# Altium schematic sheet fpga_v3.SchDoc
size A0
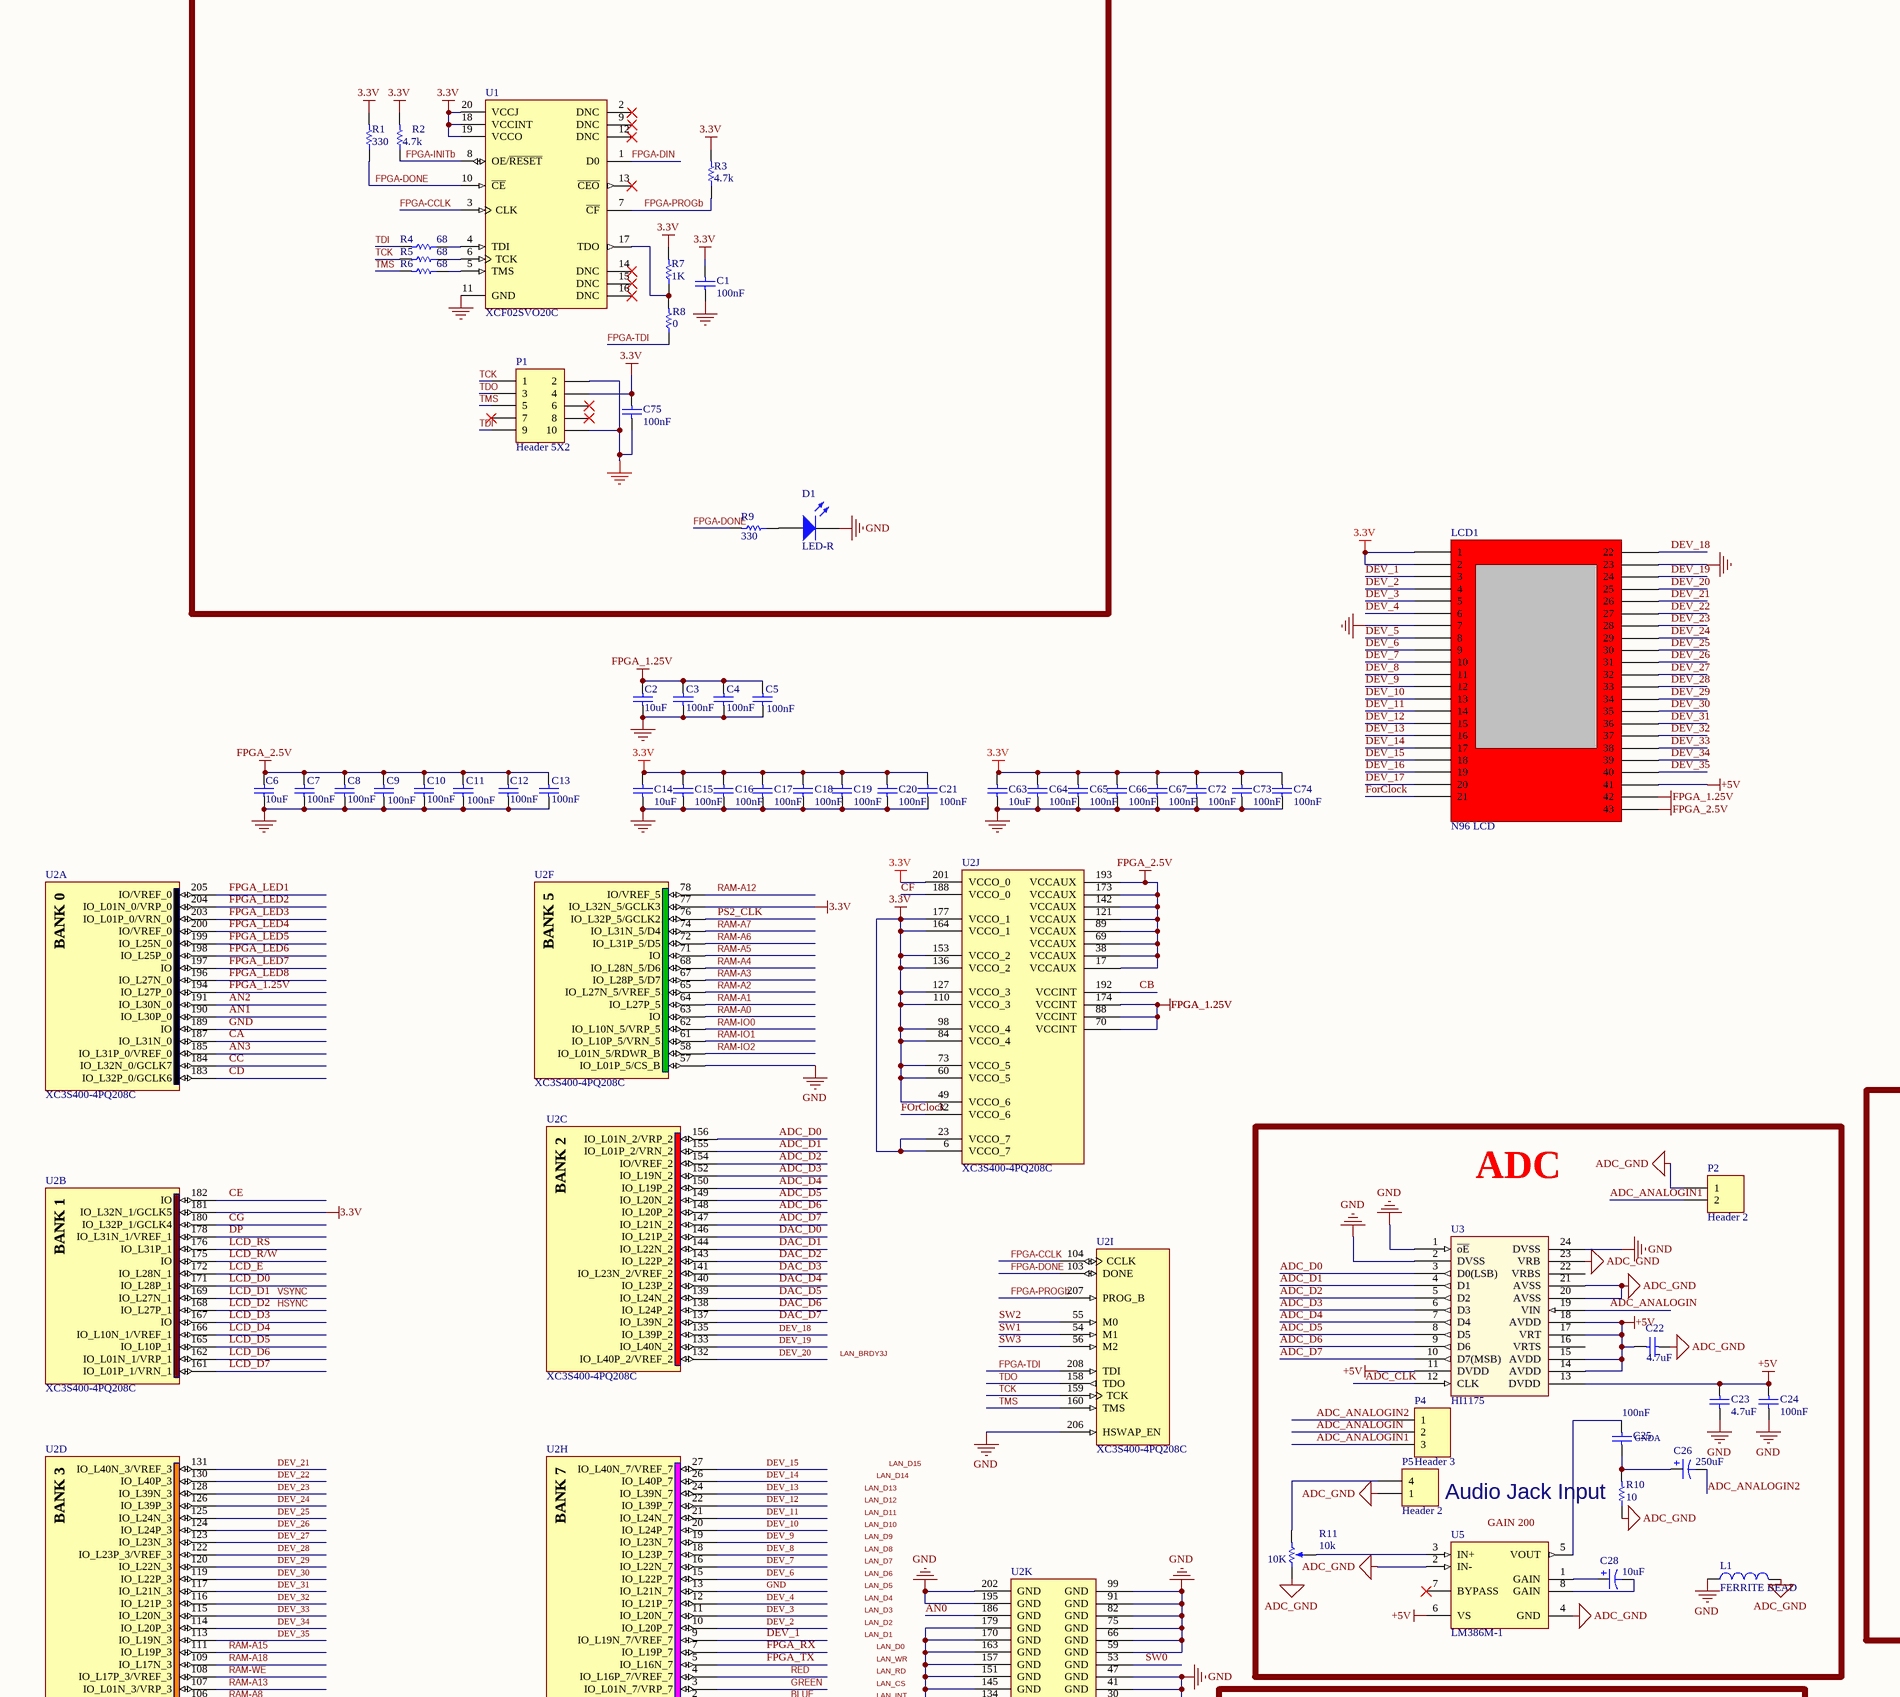
[diagram p0: fpga_v3.SchDoc, top left]
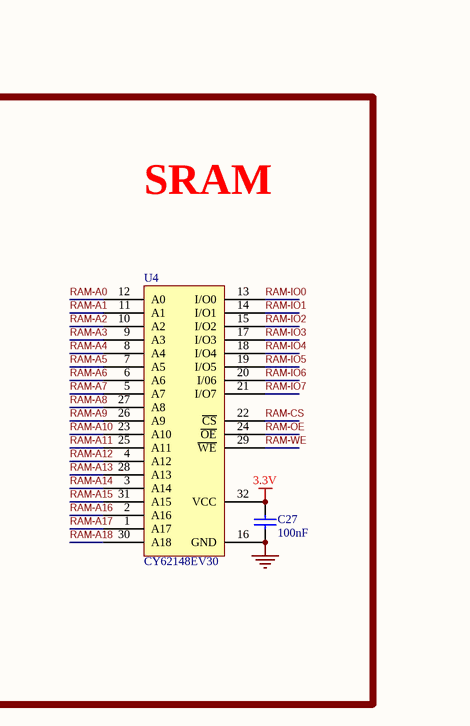
[diagram p1: fpga_v3.SchDoc, top right]
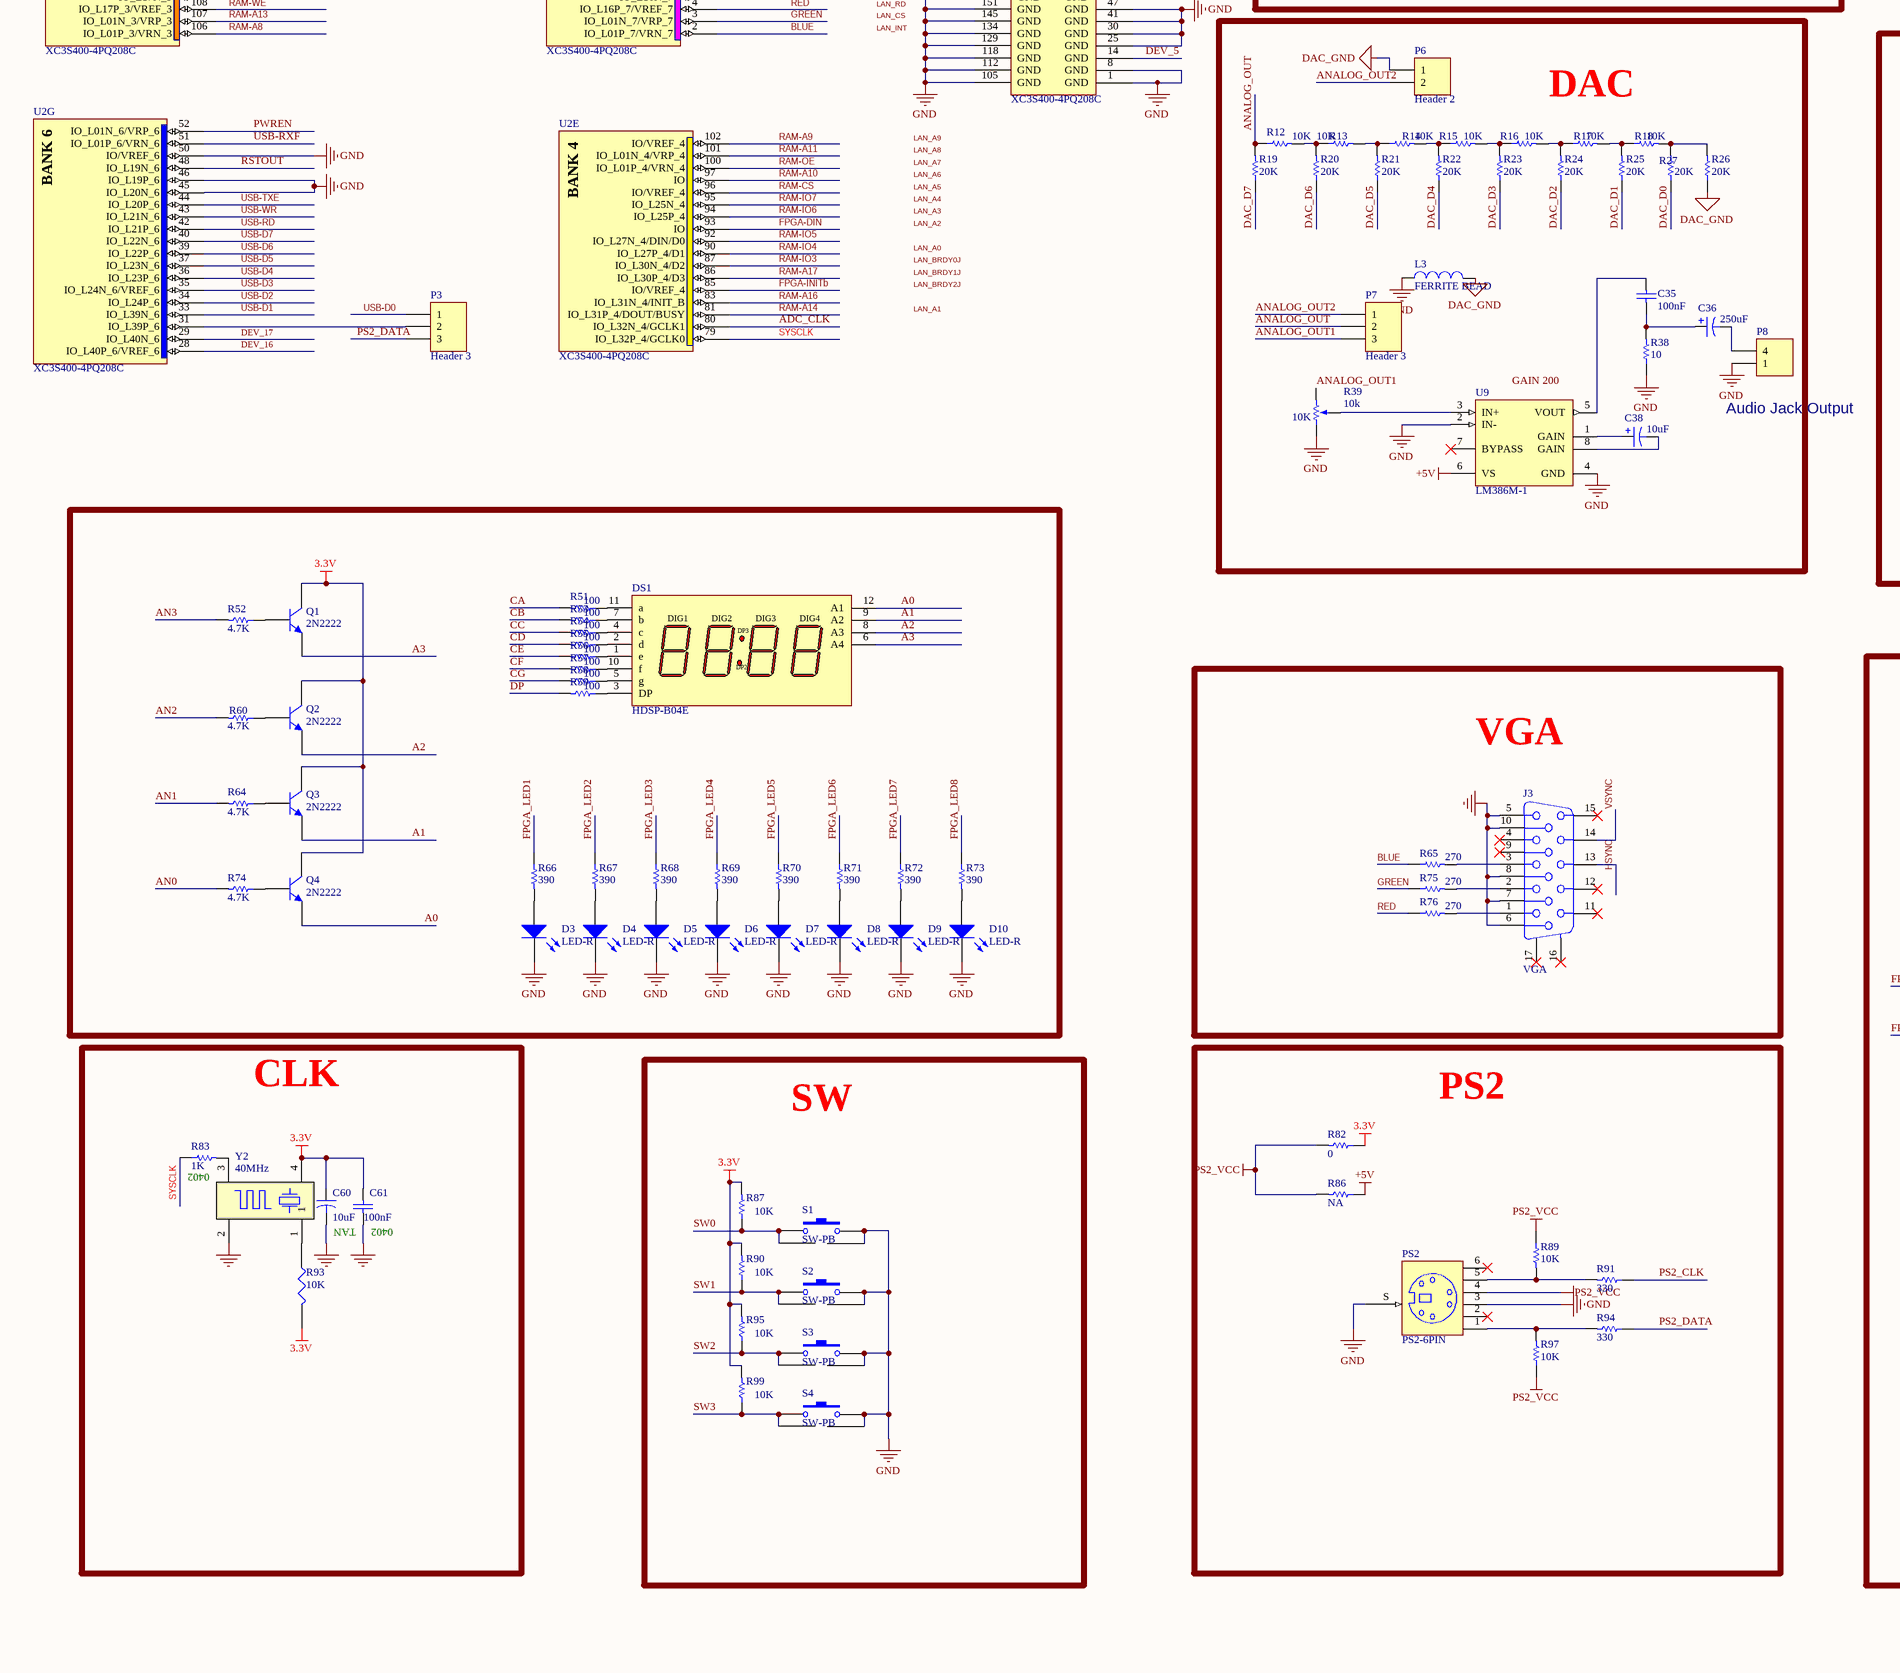
[diagram p2: fpga_v3.SchDoc, bottom left]
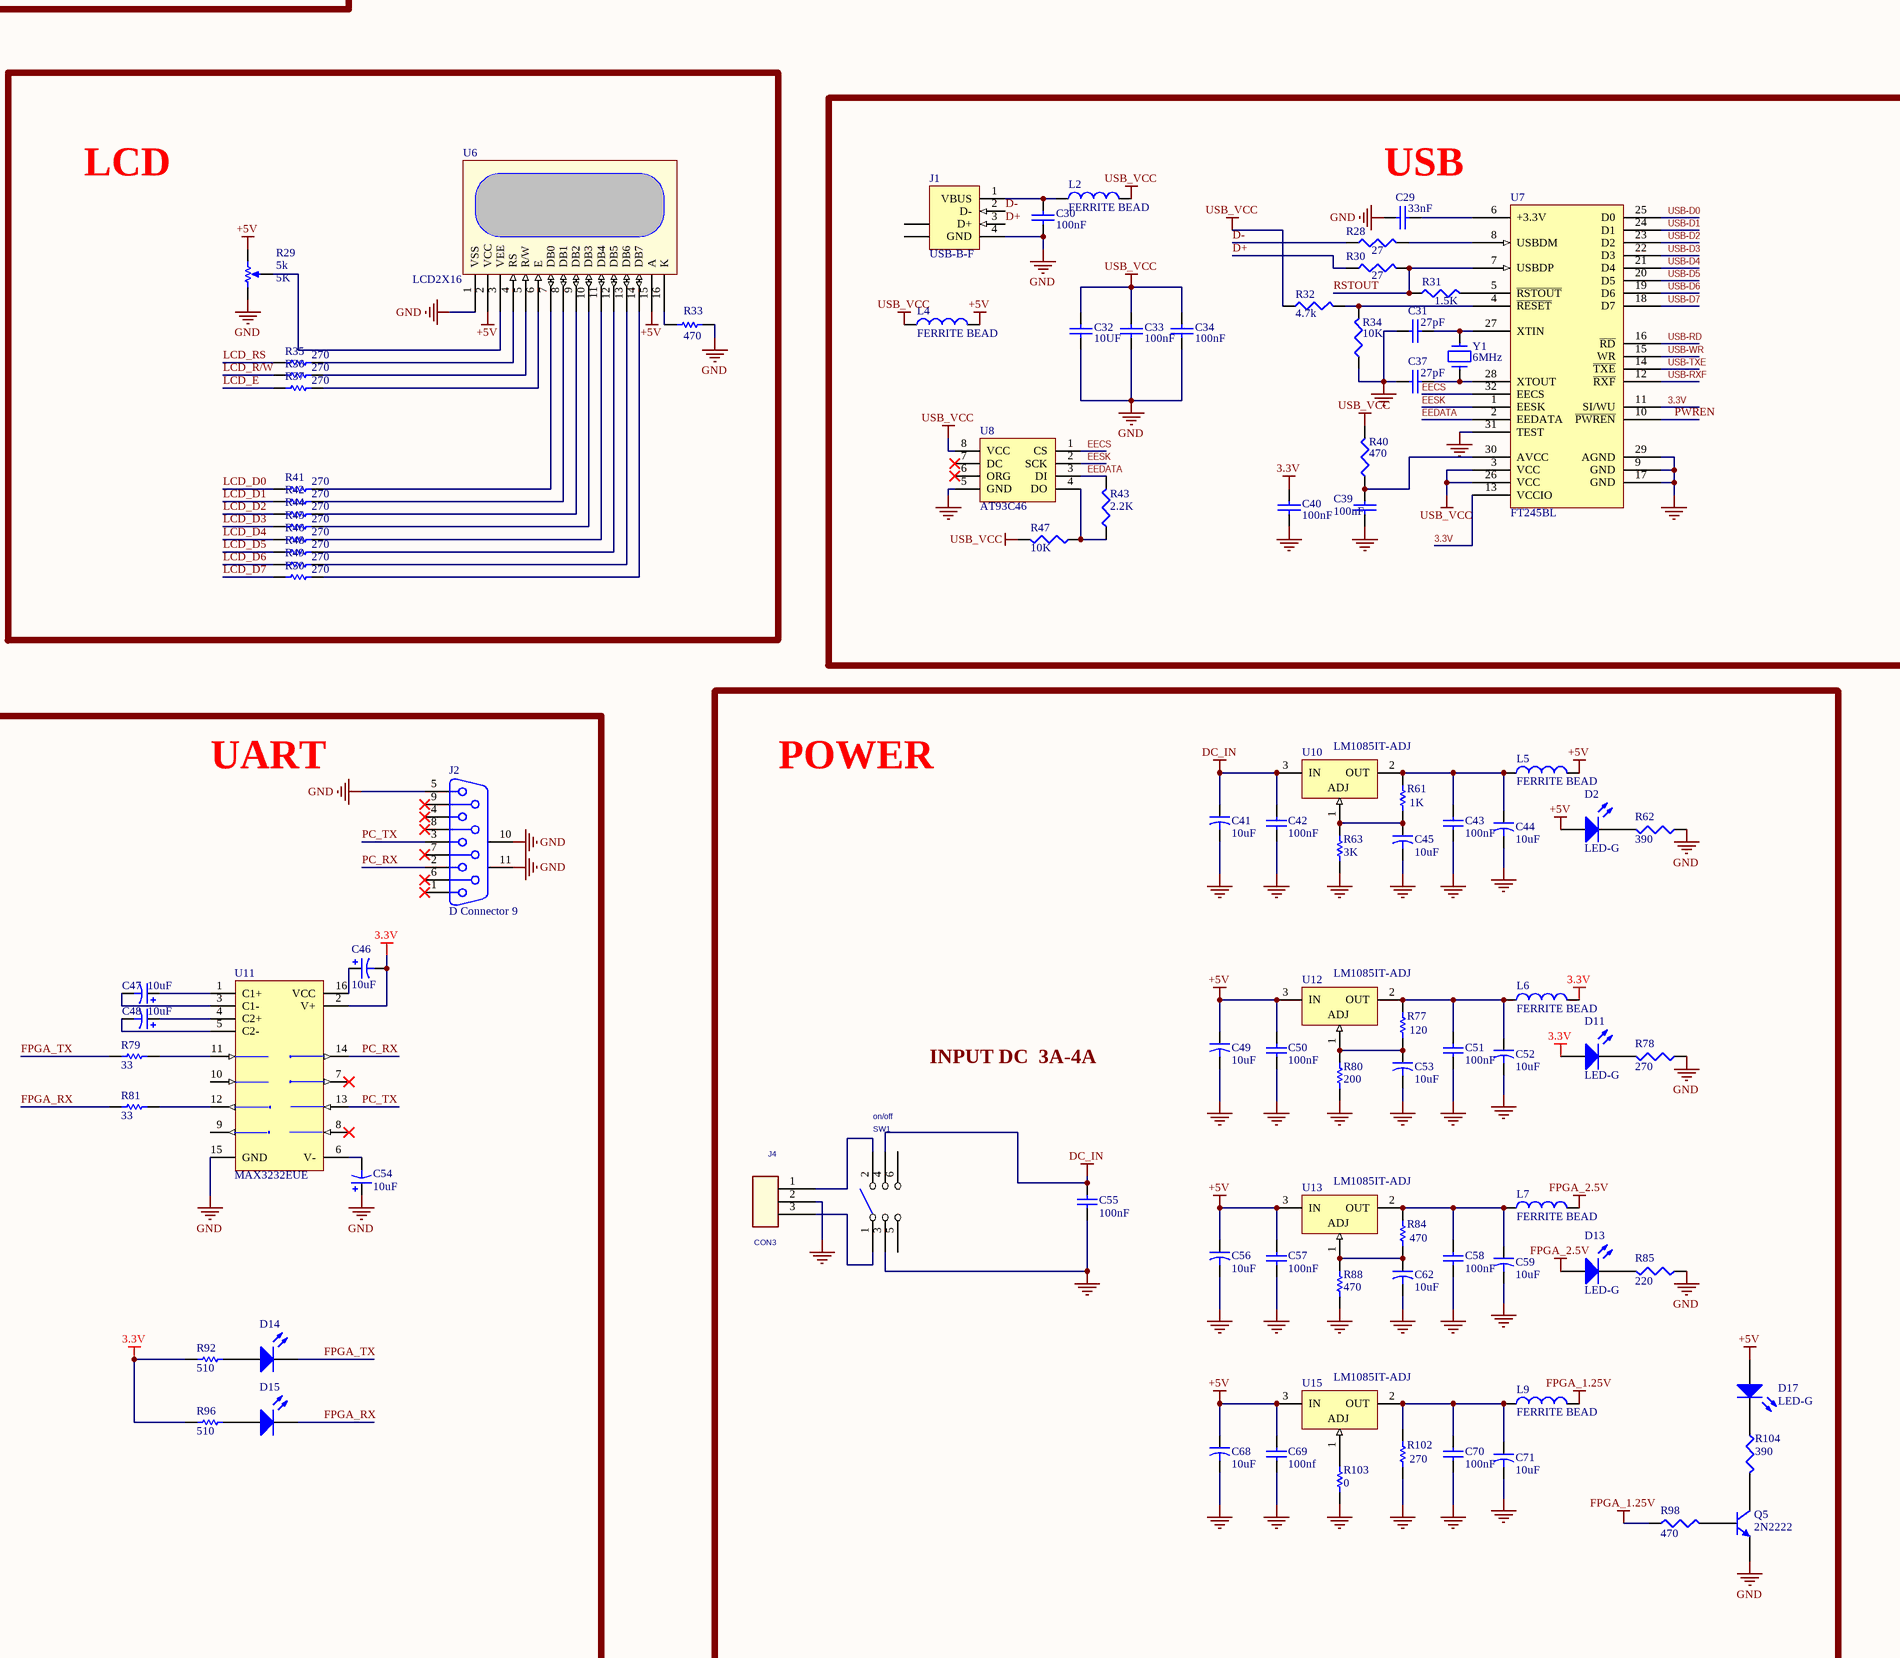
[diagram p3: fpga_v3.SchDoc, bottom right]

## Parts
C1  100nF  [0805]
C2  10uF  [0805]
C3  100nF  [0805]
C4  100nF  [0805]
C5  100nF  [0805]
C6  10uF  [0805]
C7  100nF  [0805]
C8  100nF  [0805]
C9  100nF  [0805]
C10  100nF  [0805]
C11  100nF  [0805]
C12  100nF  [0805]
C13  100nF  [0805]
C14  10uF  [0805]
C15  100nF  [0805]
C16  100nF  [0805]
C17  100nF  [0805]
C18  100nF  [0805]
C19  100nF  [0805]
C20  100nF  [0805]
C21  100nF  [0805]
C22  4.7uF  [0805]
C23  4.7uF  [0805]
C24  100nF  [0805]
C25  100nF  [0805]
C26  250uF  [1210]
C27  100nF  [0805]
C28  10uF  [0805]
C29  33nF  [0805]
C30  100nF  [0805]
C31  27pF  [0805]
C32  10UF  [0805]
C33  100nF  [0805]
C34  100nF  [0805]
C35  100nF  [0805]
C36  250uF  [1210]
C37  27pF  [0805]
C38  10uF  [0805]
C39  100nF  [0805]
C40  100nF  [0805]
C41  10uF  [0805]
C42  100nF  [0805]
C43  100nF  [0805]
C44  10uF  [0805]
C45  10uF  [0805]
C46  10uF  [0805]
C47  10uF  [0805]
C48  10uF  [0805]
C49  10uF  [0805]
C50  100nF  [0805]
C51  100nF  [0805]
C52  10uF  [0805]
C53  10uF  [0805]
C54  10uF  [0805]
C55  100nF  [0805]
C56  10uF  [0805]
C57  100nF  [0805]
C58  100nF  [0805]
C59  10uF  [0805]
C60  10uF  [c1206]
C61  100nF  [0805]
C62  10uF  [0805]
C63  10uF  [0805]
C64  100nF  [0805]
C65  100nF  [0805]
C66  100nF  [0805]
C67  100nF  [0805]
C68  10uF  [0805]
C69  100nf  [0805]
C70  100nF  [0805]
C71  10uF  [0805]
C72  100nF  [0805]
C73  100nF  [0805]
C74  100nF  [0805]
C75  100nF  [0805]
D1  LED-R  [0805AK]
D2  LED-G  [0805AK]
D3  LED-R  [0805AK]
D4  LED-R  [0805AK]
D5  LED-R  [0805AK]
D6  LED-R  [0805AK]
D7  LED-R  [0805AK]
D8  LED-R  [0805AK]
D9  LED-R  [0805AK]
D10  LED-R  [0805AK]
D11  LED-G  [0805AK]
D13  LED-G  [0805AK]
D14  LED-R  [0805AK]  (value not drawn)
D15  LED-R  [0805AK]  (value not drawn)
D17  LED-G  [0805AK]
DS1  HDSP-B04E  [HDSP-B4]
J1  USB-B-F  [USB2]
J2  D Connector 9  [DSUB1.385-2H9]
J3  VGA  [DB15SLC]
J4  CON3  [POWER JACK]
L1  FERRITE BEAD  [0805]
L2  FERRITE BEAD  [0805]
L3  FERRITE BEAD  [0805]
L4  FERRITE BEAD  [0805]
L5  FERRITE BEAD  [1206]
L6  FERRITE BEAD  [1206]
L7  FERRITE BEAD  [1206]
L9  FERRITE BEAD  [1206]
LCD1  N96 LCD  [Development]
P1  Header 5X2  [HDR2X5]
P2  Header 2  [HDR1X2]
P3  Header 3  [HDR1X3]
P4  Header 3  [HDR1X3]
P5  Header 2  [my_headphone]
P6  Header 2  [HDR1X2]
P7  Header 3  [HDR1X3]
P8  Header 2  [my_headphone]  (value not drawn)
PS2  PS2-6PIN  [PS2-6PIN]
Q1  2N2222  [SOT23_N]
Q2  2N2222  [SOT23_N]
Q3  2N2222  [SOT23_N]
Q4  2N2222  [SOT23_N]
Q5  2N2222  [SOT23_N]
R1  330  [0805]
R2  4.7k  [0805]
R3  4.7k  [0805]
R4  68  [0805]
R5  68  [0805]
R6  68  [0805]
R7  1K  [0805]
R8  0  [0805]
R9  330  [0805]
R10  10  [0805]
R11  10k  [VR5]
R12  10K  [0805]
R13  10K  [0805]
R14  10K  [0805]
R15  10K  [0805]
R16  10K  [0805]
R17  10K  [0805]
R18  10K  [0805]
R19  20K  [0805]
R20  20K  [0805]
R21  20K  [0805]
R22  20K  [0805]
R23  20K  [0805]
R24  20K  [0805]
R25  20K  [0805]
R26  20K  [0805]
R27  20K  [0805]
R28  27  [0805]
R29  5k  [POT MINI]
R30  27  [0805]
R31  1.5K  [0805]
R32  4.7k  [0805]
R33  470  [0805]
R34  10K  [0805]
R35  270  [0805]
R36  270  [0805]
R37  270  [0805]
R38  10  [0805]
R39  10k  [VR5]
R40  470  [0805]
R41  270  [0805]
R42  270  [0805]
R43  2.2K  [0805]
R44  270  [0805]
R45  270  [0805]
R46  270  [0805]
R47  10K  [0805]
R48  270  [0805]
R49  270  [0805]
R50  270  [0805]
R51  100  [0805]
R52  4.7K  [0805]
R53  100  [0805]
R54  100  [0805]
R55  100  [0805]
R56  100  [0805]
R57  100  [0805]
R58  100  [0805]
R59  100  [0805]
R60  4.7K  [0805]
R61  1K  [0805]
R62  390  [0805]
R63  3K  [0805]
R64  4.7K  [0805]
R65  270  [0805]
R66  390  [0805]
R67  390  [0805]
R68  390  [0805]
R69  390  [0805]
R70  390  [0805]
R71  390  [0805]
R72  390  [0805]
R73  390  [0805]
R74  4.7K  [0805]
R75  270  [0805]
R76  270  [0805]
R77  120  [0805]
R78  270  [0805]
R79  33  [0805]
R80  200  [0805]
R81  33  [0805]
R82  0  [0805]
R83  1K  [0805]
R84  470  [0805]
R85  220  [0805]
R86  NA  [0805]
R87  10K  [0805]
R88  470  [0805]
R89  10K  [0805]
R90  10K  [0805]
R91  330  [0805]
R92  510  [0805]
R93  10K  [0805]
R94  330  [0805]
R95  10K  [0805]
R96  510  [0805]
R97  10K  [0805]
R98  470  [0805]
R99  10K  [0805]
R102  270  [0805]
R103  0  [0805]
R104  390  [0805]
S1  SW-PB  [Buttom]
S2  SW-PB  [Buttom]
S3  SW-PB  [Buttom]
S4  SW-PB  [Buttom]
SW1  on/off  [SWITCH]
U1  XCF02SVO20C  [VOG20_L]
U2  XC3S400-4PQ208C  [PQ208_N]  (parts A,B,C,D,E,F,G,H,I,J,K of 11)
U3  HI1175  [SOIC127P1030X264-24N]
U4  CY62148EV30  [SOP32]
U5  LM386M-1  [D008_M]
U6  LCD2X16  [LCD]
U7  FT245BL  [sol-32]
U8  AT93C46  [so-8]
U9  LM386M-1  [D008_M]
U10  LM1085IT-ADJ  [DDPAK-EB3_M]
U11  MAX3232EUE  [SO-16]
U12  LM1085IT-ADJ  [DDPAK-EB3_M]
U13  LM1085IT-ADJ  [DDPAK-EB3_M]
U15  LM1085IT-ADJ  [DDPAK-EB3_M]
Y1  6MHz  [XTAL-2]
Y2  40MHz  [OSC-2]

## Blocks framed on the sheet
SRAM: C27 U4
ADC: C22-C26 C28 L1 P2 P4 P5 R10 R11 U3 U5
DAC: C35 C36 C38 L3 P6-P8 R12-R27 R38 R39 U9
LCD: R29 R33 R35-R37 R41 R42 R44-R46 R48-R50 U6
USB: C29-C34 C37 C39 C40 J1 L2 L4 R28 R30-R32 R34 R40 R43 R47 U7 U8 Y1
POWER: C41-C45 C49-C53 C55-C59 C62 C68-C71 D2 D11 D13 D17 J4 L5-L7 L9 Q5 R61-R63 R77 R78 R80 R84 R85 R88 R98 R102-R104 SW1 U10 U12 U13 U15
VGA: J3 R65 R75 R76
UART: C46-C48 C54 D14 D15 J2 R79 R81 R92 R96 U11
CLK: C60 C61 R83 R93 Y2
SW: R87 R90 R95 R99 S1-S4
PS2: PS2 R82 R86 R89 R91 R94 R97

## Nets
3.3V: C1.2 C14.2 C15.2 C16.2 C17.2 C18.2 C19.2 C20.2 C21.2 C27.2 C40.1 C46.2 C60.1 C61.2 C63.2 C64.2 C65.2 C66.2 C67.2 C72.2 C73.2 C74.2 C75.2 D11.1(A) L6.2 LCD1.1 LCD1.2 P1.4 Q1.3(B) Q2.3(B) Q3.3(B) Q4.3(B) R1.2 R2.2 R3.2 R7.2 R82.1 R87.2 R90.2 R92.1 R93.2 R95.2 R96.1 R99.2 U1.18(VCCINT) U1.19(VCCO) U1.20(VCCJ) U2.6(VCCO_7) U2.23(VCCO_7) U2.49(VCCO_6) U2.60(VCCO_5) U2.73(VCCO_5) U2.77(IO_L32N_5/GCLK3) U2.84(VCCO_4) U2.98(VCCO_4) U2.110(VCCO_3) U2.127(VCCO_3) U2.136(VCCO_2) U2.153(VCCO_2) U2.164(VCCO_1) U2.177(VCCO_1) U2.181(IO_L32N_1/GCLK5) U2.201(VCCO_0) U4.32(VCC) U7.11(SI/WU) U7.13(VCCIO) U11.2(V+) Y2.4
+5V: C22.2 C23.2 C24.2 C49.1 C50.1 C56.1 C57.1 C68.1 C69.1 D2.1(A) D17.1(A) L4.2 L5.2 LCD1.41 R29.2(BOT) R86.1 U3.11(DVDD) U3.13(DVDD) U3.14(AVDD) U3.15(AVDD) U3.17(VRT) U3.18(AVDD) U5.6(VS) U6.2(VCC) U6.15(A) U9.6(VS) U12.3(IN) U13.3(IN) U15.3(IN)
ADC_GND: C22.1 L1.2 P2.1 P5.1 R10.1 R11.1(TOP) U3.20(AVSS) U3.21(AVSS) U3.23(VRB) U5.2(IN-) U5.4(GND)
DAC_GND: L3.2 P6.1 R26.1
DC_IN: C41.1 C42.1 C55.2 SW1.4 U10.3(IN)
FPGA_1.25V: C2.2 C3.2 C4.2 C5.2 L9.2 LCD1.42 R98.1 U2.70(VCCINT) U2.88(VCCINT) U2.174(VCCINT) U2.194(IO_L27P_0)
FPGA_2.5V: C6.2 C7.2 C8.2 C9.2 C10.2 C11.2 C12.2 C13.2 D13.1(A) L7.2 LCD1.43 U2.17(VCCAUX) U2.38(VCCAUX) U2.69(VCCAUX) U2.89(VCCAUX) U2.121(VCCAUX) U2.142(VCCAUX) U2.173(VCCAUX) U2.193(VCCAUX)
GND: C1.1 C2.1 C3.1 C4.1 C5.1 C6.1 C7.1 C8.1 C9.1 C10.1 C11.1 C12.1 C13.1 C14.1 C15.1 C16.1 C17.1 C18.1 C19.1 C20.1 C21.1 C23.1 C24.1 C27.1 C29.1 C30.2 C31.1 C32.2 C33.2 C34.2 C37.1 C39.2 C40.2 C41.2 C42.2 C43.2 C44.2 C45.2 C49.2 C50.2 C51.2 C52.2 C53.2 C54.1 C55.1 C56.2 C57.2 C58.2 C59.2 C60.2 C61.1 C62.2 C63.1 C64.1 C65.1 C66.1 C67.1 C68.2 C69.2 C70.2 C71.2 C72.1 C73.1 C74.1 C75.1 D1.2(K) D3.2(K) D4.2(K) D5.2(K) D6.2(K) D7.2(K) D8.2(K) D9.2(K) D10.2(K) J1.4(GND) J2.5 J2.10(MH1) J2.11(MH2) J3.5 J3.6 J3.7 J3.8 J3.10 J4.2 L1.1 L3.1 LCD1.7 LCD1.23 P1.2 P1.10 P8.1 PS2.3 PS2.S Q5.2(E) R29.1(TOP) R33.1 R34.1 R38.1 R39.1(TOP) R62.1 R63.1 R78.1 R80.1 R85.1 R88.1 R102.2 R103.1 S1.2 S1.4 S2.2 S2.4 S3.2 S3.4 S4.2 S4.4 SW1.3 U1.11(GND) U2.1(GND) U2.8(GND) U2.13(IO_L21N_7) U2.25(GND) U2.30(GND) U2.41(GND) U2.45(IO_L20N_6) U2.46(IO_L19P_6) U2.47(GND) U2.50(IO/VREF_6) U2.57(IO_L01P_5/CS_B) U2.59(GND) U2.66(GND) U2.75(GND) U2.82(GND) U2.91(GND) U2.99(GND) U2.105(GND) U2.112(GND) U2.118(GND) U2.129(GND) U2.134(GND) U2.145(GND) U2.151(GND) U2.157(GND) U2.163(GND) U2.170(GND) U2.179(GND) U2.189(IO) U2.195(GND) U2.202(GND) U2.206(HSWAP_EN) U3.1(~{oE}) U3.2(DVSS) U3.24(DVSS) U4.16(GND) U6.1(VSS) U7.9(GND) U7.17(GND) U7.29(AGND) U7.31(TEST) U8.5(GND) U9.2(IN-) U9.4(GND) U11.15(GND) Y2.2
PS2_VCC: PS2.4 R82.2 R86.2 R89.1 R97.1
USB_VCC: C32.1 C33.1 C34.1 L2.2 L4.1 R32.1 R40.2 R47.2 U7.3(VCC) U7.26(VCC) U8.8(VCC)
A0: DS1.12(A1) Q4.1(C)
A1: DS1.9(A2) Q3.1(C)
A2: DS1.8(A3) Q2.1(C)
A3: DS1.6(A4) Q1.1(C)
ADC_ANALOGIN: P4.2 U3.19(VIN)
ADC_ANALOGIN1: P2.2 P4.3
ADC_ANALOGIN2: C26.2 P4.1
ADC_CLK: U2.80(IO_L32N_4/GCLK1) U3.12(CLK)
ADC_D0: U2.156(IO_L01N_2/VRP_2) U3.3(D0(LSB))
ADC_D1: U2.155(IO_L01P_2/VRN_2) U3.4(D1)
ADC_D2: U2.154(IO/VREF_2) U3.5(D2)
ADC_D3: U2.152(IO_L19N_2) U3.6(D3)
ADC_D4: U2.150(IO_L19P_2) U3.7(D4)
ADC_D5: U2.149(IO_L20N_2) U3.8(D5)
ADC_D6: U2.148(IO_L20P_2) U3.9(D6)
ADC_D7: U2.147(IO_L21N_2) U3.10(D7(MSB))
AN0: R74.2 U2.186(GND)
AN1: R64.2 U2.190(IO_L30P_0)
AN2: R60.2 U2.191(IO_L30N_0)
AN3: R52.2 U2.185(IO_L31P_0/VREF_0)
ANALOG_OUT: P7.2 R12.1 R19.2
ANALOG_OUT1: P7.3 R39.3(BOT)
ANALOG_OUT2: P6.2 P7.1
BLUE: R65.1 U2.2(IO_L01P_7/VRN_7)
CA: R51.2 U2.187(IO_L31N_0)
CB: R53.2 U2.192(VCCINT)
CC: R54.2 U2.184(IO_L32N_0/GCLK7)
CD: R55.2 U2.183(IO_L32P_0/GCLK6)
CE: R56.2 U2.182(IO)
CF: R57.2 U2.188(VCCO_0)
CG: R58.2 U2.180(IO_L32P_1/GCLK4)
D+: J1.3(D+) R30.1
D-: J1.2(D-) R28.1
DAC_D0: R27.1 U2.146(IO_L21P_2)
DAC_D1: R25.1 U2.144(IO_L22N_2)
DAC_D2: R24.1 U2.143(IO_L22P_2)
DAC_D3: R23.1 U2.141(IO_L23N_2/VREF_2)
DAC_D4: R22.1 U2.140(IO_L23P_2)
DAC_D5: R21.1 U2.139(IO_L24N_2)
DAC_D6: R20.1 U2.138(IO_L24P_2)
DAC_D7: R19.1 U2.137(IO_L39N_2)
DEV_1: LCD1.3 U2.9(IO_L19N_7/VREF_7)
DEV_2: LCD1.4 U2.10(IO_L20P_7)
DEV_3: LCD1.5 U2.11(IO_L20N_7)
DEV_4: LCD1.6 U2.12(IO_L21P_7)
DEV_5: LCD1.8 U2.14(GND)
DEV_6: LCD1.9 U2.15(IO_L22P_7)
DEV_7: LCD1.10 U2.16(IO_L22N_7)
DEV_8: LCD1.11 U2.18(IO_L23P_7)
DEV_9: LCD1.12 U2.19(IO_L23N_7)
DEV_10: LCD1.13 U2.20(IO_L24P_7)
DEV_11: LCD1.14 U2.21(IO_L24N_7)
DEV_12: LCD1.15 U2.22(IO_L39P_7)
DEV_13: LCD1.16 U2.24(IO_L39N_7)
DEV_14: LCD1.17 U2.26(IO_L40P_7)
DEV_15: LCD1.18 U2.27(IO_L40N_7/VREF_7)
DEV_16: LCD1.19 U2.28(IO_L40P_6/VREF_6)
DEV_17: LCD1.20 U2.29(IO_L40N_6)
DEV_18: LCD1.22 U2.135(IO_L39P_2)
DEV_19: LCD1.24 U2.133(IO_L40N_2)
DEV_20: LCD1.25 U2.132(IO_L40P_2/VREF_2)
DEV_21: LCD1.26 U2.131(IO_L40N_3/VREF_3)
DEV_22: LCD1.27 U2.130(IO_L40P_3)
DEV_23: LCD1.28 U2.128(IO_L39N_3)
DEV_24: LCD1.29 U2.126(IO_L39P_3)
DEV_25: LCD1.30 U2.125(IO_L24N_3)
DEV_26: LCD1.31 U2.124(IO_L24P_3)
DEV_27: LCD1.32 U2.123(IO_L23N_3)
DEV_28: LCD1.33 U2.122(IO_L23P_3/VREF_3)
DEV_29: LCD1.34 U2.120(IO_L22N_3)
DEV_30: LCD1.35 U2.119(IO_L22P_3)
DEV_31: LCD1.36 U2.117(IO_L21N_3)
DEV_32: LCD1.37 U2.116(IO_L21P_3)
DEV_33: LCD1.38 U2.115(IO_L20N_3)
DEV_34: LCD1.39 U2.114(IO_L20P_3)
DEV_35: LCD1.40 U2.113(IO_L19N_3)
DP: R59.2 U2.178(IO_L31N_1/VREF_1)
EECS: U7.32(EECS) U8.1(CS)
EEDATA: R43.2 U7.2(EEDATA) U8.3(DI)
EESK: U7.1(EESK) U8.2(SCK)
ForClock: LCD1.21 U2.32(VCCO_6)
FPGA-CCLK: U1.3(CLK) U2.104(CCLK)
FPGA-DIN: U1.1(D0) U2.93(IO)
FPGA-DONE: R1.1 R9.2 U1.10(~{CE}) U2.103(DONE)
FPGA-INITb: R2.1 U1.8(OE/~{RESET}) U2.85(IO/VREF_4)
FPGA-PROGb: R3.1 U1.7(~{CF}) U2.207(PROG_B)
FPGA-TDI: R8.1 U2.208(TDI)
FPGA_LED1: R66.1 U2.205(IO/VREF_0)
FPGA_LED2: R67.1 U2.204(IO_L01N_0/VRP_0)
FPGA_LED3: R68.1 U2.203(IO_L01P_0/VRN_0)
FPGA_LED4: R69.1 U2.200(IO/VREF_0)
FPGA_LED5: R70.1 U2.199(IO_L25N_0)
FPGA_LED6: R71.1 U2.198(IO_L25P_0)
FPGA_LED7: R72.1 U2.197(IO)
FPGA_LED8: R73.1 U2.196(IO_L27N_0)
FPGA_RX: D15.2(K) R81.1 U2.7(IO_L19P_7)
FPGA_TX: D14.2(K) R79.1 U2.5(IO_L16N_7)
GREEN: R75.1 U2.3(IO_L01N_7/VRP_7)
HSYNC: J3.13 R44.1 U2.168(IO_L27P_1)  [also labelled LCD_D2]
LCD_D0: R41.1 U2.171(IO_L28P_1)
LCD_D1: J3.14 R42.1 U2.169(IO_L27N_1)  [also labelled VSYNC]
LCD_D3: R45.1 U2.167(IO)
LCD_D4: R46.1 U2.166(IO_L10N_1/VREF_1)
LCD_D5: R48.1 U2.165(IO_L10P_1)
LCD_D6: R49.1 U2.162(IO_L01N_1/VRP_1)
LCD_D7: R50.1 U2.161(IO_L01P_1/VRN_1)
LCD_E: R37.1 U2.172(IO_L28N_1)
LCD_R/W: R36.1 U2.175(IO)
LCD_RS: R35.1 U2.176(IO_L31P_1)
PC_RX: J2.2 U11.14(T1OUT)
PC_TX: J2.3 U11.13(R1IN)
PS2_CLK: R91.1 U2.76(IO_L32P_5/GCLK2)
PS2_DATA: P3.3 R94.1
PWREN: U2.52(IO_L01N_6/VRP_6) U7.10(~{PWREN})
RAM-A0: U2.63(IO) U4.12(A0)
RAM-A1: U2.64(IO_L27P_5) U4.11(A1)
RAM-A2: U2.65(IO_L27N_5/VREF_5) U4.10(A2)
RAM-A3: U2.67(IO_L28P_5/D7) U4.9(A3)
RAM-A4: U2.68(IO_L28N_5/D6) U4.8(A4)
RAM-A5: U2.71(IO) U4.7(A5)
RAM-A6: U2.72(IO_L31P_5/D5) U4.6(A6)
RAM-A7: U2.74(IO_L31N_5/D4) U4.5(A7)
RAM-A8: U2.106(IO_L01P_3/VRN_3) U4.27(A8)
RAM-A9: U2.102(IO/VREF_4) U4.26(A9)
RAM-A10: U2.97(IO) U4.23(A10)
RAM-A11: U2.101(IO_L01N_4/VRP_4) U4.25(A11)
RAM-A12: U2.78(IO/VREF_5) U4.4(A12)
RAM-A13: U2.107(IO_L01N_3/VRP_3) U4.28(A13)
RAM-A14: U2.81(IO_L31P_4/DOUT/BUSY) U4.3(A14)
RAM-A15: U2.111(IO_L19P_3) U4.31(A15)
RAM-A16: U2.83(IO_L31N_4/INIT_B) U4.2(A16)
RAM-A17: U2.86(IO_L30P_4/D3) U4.1(A17)
RAM-A18: U2.109(IO_L17N_3) U4.30(A18)
RAM-CS: U2.96(IO/VREF_4) U4.22(~{CS})
RAM-IO0: U2.62(IO_L10N_5/VRP_5) U4.13(I/O0)
RAM-IO1: U2.61(IO_L10P_5/VRN_5) U4.14(I/O1)
RAM-IO2: U2.58(IO_L01N_5/RDWR_B) U4.15(I/O2)
RAM-IO3: U2.87(IO_L30N_4/D2) U4.17(I/O3)
RAM-IO4: U2.90(IO_L27P_4/D1) U4.18(I/O4)
RAM-IO5: U2.92(IO_L27N_4/DIN/D0) U4.19(I/O5)
RAM-IO6: U2.94(IO_L25P_4) U4.20(I/06)
RAM-IO7: U2.95(IO_L25N_4) U4.21(I/O7)
RAM-OE: U2.100(IO_L01P_4/VRN_4) U4.24(~{OE})
RAM-WE: U2.108(IO_L17P_3/VREF_3) U4.29(~{WE})
RED: R76.1 U2.4(IO_L16P_7/VREF_7)
RSTOUT: R30.2 R31.1 U2.48(IO_L19N_6) U7.7(USBDP)
SW0: R87.1 S1.1 S1.3 U2.53(GND)
SW1: R90.1 S2.1 S2.3 U2.54(M1)
SW2: R95.1 S3.1 S3.3 U2.55(M0)
SW3: R99.1 S4.1 S4.3 U2.56(M2)
SYSCLK: R83.1 U2.79(IO_L32P_4/GCLK0)
TCK: P1.1 R5.2 U2.159(TCK)
TDI: P1.9 R4.2
TDO: P1.3 U2.158(TDO)
TMS: P1.5 R6.2 U2.160(TMS)
USB-D0: P3.1 U7.25(D0)
USB-D1: U2.33(IO_L39N_6) U7.24(D1)
USB-D2: U2.34(IO_L24P_6) U7.23(D2)
USB-D3: U2.35(IO_L24N_6/VREF_6) U7.22(D3)
USB-D4: U2.36(IO_L23P_6) U7.21(D4)
USB-D5: U2.37(IO_L23N_6) U7.20(D5)
USB-D6: U2.39(IO_L22P_6) U7.19(D6)
USB-D7: U2.40(IO_L22N_6) U7.18(D7)
USB-RD: U2.42(IO_L21P_6) U7.16(~{RD})
USB-RXF: U2.51(IO_L01P_6/VRN_6) U7.12(~{RXF})
USB-TXE: U2.44(IO_L20P_6) U7.14(~{TXE})
USB-WR: U2.43(IO_L21N_6) U7.15(WR)
NetC25_1: C25.1 U5.5(VOUT)
NetC25_2: C25.2 C26.1 R10.2
NetC28_1: C28.1 U5.1(GAIN)
NetC28_2: C28.2 U5.8(GAIN)
NetC29_2: C29.2 U7.6(+3.3V)
NetC30_1: C30.1 J1.1(VBUS) L2.1
NetC31_2: C31.2 U7.27(XTIN) Y1.2
NetC35_1: C35.1 U9.5(VOUT)
NetC35_2: C35.2 C36.1 R38.2
NetC36_2: C36.2 P8.4
NetC37_2: C37.2 U7.28(XTOUT) Y1.1
NetC38_1: C38.1 U9.1(GAIN)
NetC38_2: C38.2 U9.8(GAIN)
NetC39_1: C39.1 R40.1 U7.30(AVCC)
NetC43_1: C43.1 C44.1 L5.1 R61.1 U10.2(OUT)
NetC45_1: C45.1 R61.2 R63.2 U10.1(ADJ)
NetC46_1: C46.1 U11.16(VCC)
NetC47_1: C47.1 U11.1(C1+)
NetC47_2: C47.2 U11.3(C1-)
NetC48_1: C48.1 U11.4(C2+)
NetC48_2: C48.2 U11.5(C2-)
NetC51_1: C51.1 C52.1 L6.1 R77.1 U12.2(OUT)
NetC53_1: C53.1 R77.2 R80.2 U12.1(ADJ)
NetC54_2: C54.2 U11.6(V-)
NetC58_1: C58.1 C59.1 L7.1 R84.1 U13.2(OUT)
NetC62_1: C62.1 R84.2 R88.2 U13.1(ADJ)
NetC70_1: C70.1 C71.1 L9.1 R102.1 U15.2(OUT)
NetD1_1: D1.1(A) R9.1
NetD2_2: D2.2(K) R62.2
NetD3_1: D3.1(A) R66.2
NetD4_1: D4.1(A) R67.2
NetD5_1: D5.1(A) R68.2
NetD6_1: D6.1(A) R69.2
NetD7_1: D7.1(A) R70.2
NetD8_1: D8.1(A) R71.2
NetD9_1: D9.1(A) R72.2
NetD10_1: D10.1(A) R73.2
NetD11_2: D11.2(K) R78.2
NetD13_2: D13.2(K) R85.2
NetD14_1: D14.1(A) R92.2
NetD15_1: D15.1(A) R96.2
NetD17_2: D17.2(K) R104.1
NetDS1_1: DS1.1(e) R56.1
NetDS1_2: DS1.2(d) R55.1
NetDS1_3: DS1.3(DP) R59.1
NetDS1_4: DS1.4(c) R54.1
NetDS1_5: DS1.5(g) R58.1
NetDS1_7: DS1.7(b) R53.1
NetDS1_10: DS1.10(f) R57.1
NetDS1_11: DS1.11(a) R51.1
NetJ3_1: J3.1 R76.2
NetJ3_2: J3.2 R75.2
NetJ3_3: J3.3 R65.2
NetJ4_1: J4.1 SW1.2
NetJ4_3: J4.3 SW1.1
NetP3_2: P3.2 U2.31(IO_L39P_6)
NetP5_4: P5.4 R11.3(BOT)
NetPS2_1: PS2.1 R94.2 R97.2
NetPS2_5: PS2.5 R89.2 R91.2
NetQ1_2: Q1.2(E) R52.1
NetQ2_2: Q2.2(E) R60.1
NetQ3_2: Q3.2(E) R64.1
NetQ4_2: Q4.2(E) R74.1
NetQ5_1: Q5.1(C) R104.2
NetQ5_3: Q5.3(B) R98.2
NetR4_1: R4.1 U1.4(TDI)
NetR5_1: R5.1 U1.6(TCK)
NetR6_1: R6.1 U1.5(TMS)
NetR7_1: R7.1 R8.2 U1.17(TDO)
NetR11_2: R11.2(TAP) U5.3(IN+)
NetR12_2: R12.2 R13.1 R20.2
NetR13_2: R13.2 R14.1 R21.2
NetR14_2: R14.2 R15.1 R22.2
NetR15_2: R15.2 R16.1 R23.2
NetR16_2: R16.2 R17.1 R24.2
NetR17_2: R17.2 R18.1 R25.2
NetR18_2: R18.2 R26.2 R27.2
NetR28_2: R28.2 U7.8(USBDM)
NetR29_3: R29.3(TAP) U6.3(VEE)
NetR31_2: R31.2 U7.5(~{RSTOUT})
NetR32_2: R32.2 R34.2 U7.4(~{RESET})
NetR33_2: R33.2 U6.16(K)
NetR35_2: R35.2 U6.4(RS)
NetR36_2: R36.2 U6.5(R/W)
NetR37_2: R37.2 U6.6(E)
NetR39_2: R39.2(TAP) U9.3(IN+)
NetR41_2: R41.2 U6.7(DB0)
NetR42_2: R42.2 U6.8(DB1)
NetR43_1: R43.1 R47.1 U8.4(DO)
NetR44_2: R44.2 U6.9(DB2)
NetR45_2: R45.2 U6.10(DB3)
NetR46_2: R46.2 U6.11(DB4)
NetR48_2: R48.2 U6.12(DB5)
NetR49_2: R49.2 U6.13(DB6)
NetR50_2: R50.2 U6.14(DB7)
NetR79_2: R79.2 U11.11(T1IN)
NetR81_2: R81.2 U11.12(R1OUT)
NetR83_2: R83.2 Y2.3
NetR93_1: R93.1 Y2.1
NetR103_2: R103.2 U15.1(ADJ)

Not connected (* = marked no-connect by the designer): J1 5(SHLD) 6(SHLD); J2 1* 4* 6* 7* 8* 9*; J3 4* 9* 11* 12* 15* 16(MH1)* 17(MH2)*; P1 6* 7* 8*; PS2 2* 6*; SW1 5 6; U1 2(DNC)* 9(DNC)* 12(DNC)* 13(~{CEO})* 14(DNC)* 15(DNC)* 16(DNC)*; U3 16(VRTS) 22(VRBS); U5 7(BYPASS)*; U8 6(ORG)* 7(DC)*; U9 7(BYPASS)*; U11 7(T2OUT)* 8(R2IN)* 9(R2OUT) 10(T2IN)

## Notes on the sheet
- (near C25) GNDA
- (near R10) Audio Jack Input
- (near P8) Audio Jack Output
- 0402
- TAN
- (near C61) 0402
- Labels drawn without touching a wire or pin: GAIN 200, INPUT DC  3A-4A, LAN_A0, LAN_A1, LAN_A2, LAN_A3, LAN_A4, LAN_A5, LAN_A6, LAN_A7, LAN_A8, LAN_A9, LAN_BRDY0J, LAN_BRDY1J, LAN_BRDY2J, LAN_BRDY3J, LAN_CS, LAN_D0, LAN_D1, LAN_D2, LAN_D3, LAN_D4, LAN_D5, LAN_D6, LAN_D7, LAN_D8, LAN_D9, LAN_D10, LAN_D11, LAN_D12, LAN_D13, LAN_D14, LAN_D15, LAN_INT, LAN_RD, LAN_WR
- (in symbol HDSP-B04E) DIG1; DIG2; DIG3; DIG4; DP3; DP2
- (in symbol XC3S400-4PQ208C, part A) BANK 0
- (in symbol XC3S400-4PQ208C, part B) BANK 1
- (in symbol XC3S400-4PQ208C, part C) BANK 2
- (in symbol XC3S400-4PQ208C, part D) BANK 3
- (in symbol XC3S400-4PQ208C, part E) BANK 4
- (in symbol XC3S400-4PQ208C, part F) BANK 5
- (in symbol XC3S400-4PQ208C, part G) BANK 6
- (in symbol XC3S400-4PQ208C, part H) BANK 7

## Library data of the parts
C1 C75 = Cap: Capacitor; Value: 100n; Published: 8-Jun-2000; LatestRevisionDate: 17-Jul-2002; LatestRevisionNote: Re-released for DXP Platform.; PackageReference: RAD-0.3; Publisher: Altium Limited
C2-C24 C27 C55 C63-C67 C72-C74 = Cap: Capacitor; Published: 8-Jun-2000; LatestRevisionDate: 17-Jul-2002; LatestRevisionNote: Re-released for DXP Platform.; PackageReference: RAD-0.3; Publisher: Altium Limited
  C22 C23: Value: 4.7uF
  C24: Value: 100nF
C25 C35 C42 C43 C50 C51 C57 C58 C61 C69 C70 = cap: Capacitor; Published: 8-Jun-2000; LatestRevisionDate: 17-Jul-2002; LatestRevisionNote: Re-released for DXP Platform.; PackageReference: RAD-0.3; Publisher: Altium Limited
C26 C28 C36 C38 C46-C48 C54 = Cap Pol3: Polarized Capacitor (Surface Mount); Published: 8-Jun-2000; LatestRevisionDate: 17-Jul-2002; LatestRevisionNote: Re-released for DXP Platform.; PackageReference: C0805; Publisher: Altium Limited
  C26 C36: Value: 250uF
  C28 C38 C46-C48 C54: Value: 10uF
C29-C34 C37 C39 C40 = CAP: Capacitor
C41 C44 C45 C49 C52 C53 C56 C59 C60 C62 C68 C71 = cap2: Capacitor; Published: 23-Sep-2002; PackageReference: CAPR5-4X5; Publisher: Altium Limited
D1-D11 D13 D17 = LED3: Typical BLUE SiC LED; Revision 1: Jul-2002: Re-released for DXP Platform.; Revision 2: 17-Dec-2003: PCB Footprint replaced.; Published: 8-Jun-2000; Publisher: Altium Limited
D14 D15 = LED0: Typical INFRARED GaAs LED; Published: 8-Jun-2000; LatestRevisionDate: 08-Jul-2005; LatestRevisionNote: Mech Layer 1 removed.; PackageReference: LED-0; Publisher: Altium Limited
DS1 = HDSP-B04E: 14.22 mm GaP HER, Untinted, 88:88 4-Digit 7-Segment Display: CA, Gray Surface; LuminousIntensity: 3200 ucd (Minimum).; LED_Colour: High Efficiency Red (HER); Published: 26-May-2004; LatestRevisionDate: 11-Oct-2004; LatestRevisionNote: Display outline superimposed on PCB Footprint.; DatasheetVersion: 21-Aug-2001; PackageVersion: 21-Aug-2001; PackageReference: B-88; Publisher: Altium Limited; PackageDescription: LED, 7-Segment Display, 14.22 mm, Four Digit, 88:88; 12 Leads; Row Space 15.24 mm; Pitch 2.54 mm; ComponentLink1Description: Manufacturer Link; ComponentLink1URL: http://www.agilent.com/; ComponentLink2Description: Datasheet; ComponentLink2URL: http://cp.literature.agilent.com/litweb/pdf/5988-3569EN.pdf
J1 = 440119-3: USB 1.1, Right Angle, Thru-Hole, B Type, Receptacle, 4 Position, Beige; ContactMaterial: Copper Alloy; ContactPlating: Gold (5) over Nickel; TerminationLength: 2.84mm [0.112in.]; PCB_Layout: Complies with manufacturer's recommendation.; DrillSize: Corresponds to nominal value.; PanelGround: Without; Published: 15-Jul-2004; DatasheetDocument: 12-Jan-2004; PackageDocument: 12-Jan-2004; PackageReference: 440119; Publisher: Altium Limited; HousingMaterial: Thermoplastic; ComponentLink1Description: Manufacturer Link; ComponentLink1URL: http://www.tycoelectronics.com/; ComponentLink2Description: Packaging Specification; ComponentLink2URL: http://ecommas.tycoelectronics.com/commerce/DocumentDelivery/DDEController?Action=showdoc&DocId=Customer+Drawing%7F440119%7FC%7Ftif%7FEnglish%7FC_440119_C.tif
J2 = D Connector 9: Receptacle Assembly, 9 Position, Right Angle; PackageDocument: O; Positions: 9; Published: 15-Jun-2001; LatestRevisionDate: 17-Jul-2002; LatestRevisionNote: Re-released for DXP Platform.; DatasheetDocument: 1-Sep-1999; PackageReference: 788750; Publisher: Altium Limited; Orientation: Right Angle; Gender: Receptacle
J3 = Connector 15: Receptacle Assembly, 15-Pin, Sim Line Connector; PackageDocument: B; Positions: 15; Gender: Receptacle Header; Published: 15-Jun-2001; LatestRevisionDate: 17-Jul-2002; LatestRevisionNote: Re-released for DXP Platform.; DatasheetDocument: 24-Nov-1999; PackageReference: 788574; Publisher: Altium Limited; Orientation: Right Angle
L1-L7 L9 = Inductor: Code_IEC: 1005; Value: 10mH; Published: 8-Jun-2000; LatestRevisionDate: 17-Jul-2002; LatestRevisionNote: Re-released for DXP Platform.; PackageReference: 0402-A; Publisher: Altium Limited; Code_JEITA: 0402
P1 = Header 5X2: Header, 5-Pin, Dual row; LatestRevisionDate: 17-Jul-2002; LatestRevisionNote: Re-released for DXP Platform.; Publisher: Altium Limited
P2 P5 P6 P8 = Header 2: Header, 2-Pin; LatestRevisionDate: 17-Jul-2002; LatestRevisionNote: Re-released for DXP Platform.; Publisher: Altium Limited
P3 P4 P7 = Header 3: Header, 3-Pin; LatestRevisionDate: 17-Jul-2002; LatestRevisionNote: Re-released for DXP Platform.; Publisher: Altium Limited
PS2 = PS2-6PIN: 6 Pin Through Hole PS2 Socket (Kycon P/N); Published: 17-Dec-2003; Publisher: Altium Limited; ComponentLink1Description: Manufacturer Link; ComponentLink1URL: http://www.oupiin.com/prodindx.html#Headers
Q1-Q4 = 2N3904: NPN General Purpose Amplifier; pin to pad: 1>2 2>3 3>1; Published: 8-Jun-2000; LatestRevisionDate: 15-Jan-2003; LatestRevisionNote: PCB Footprint 'BCY-W3/D4.7' replaced; DatasheetVersion: 1997; PackageVersion: Sep-1998; PackageReference: TO-92A; Publisher: Altium Limited; PackageDescription: TO, Flat Index; 3 In-Line, Axial Leads; Body Dia. 4.5mm; Leads 0.51 x 0.48 mm (max); ComponentLink1Description: Manufacturer Link; ComponentLink1URL: http://www.fairchildsemi.com/; ComponentLink2Description: Datasheet; ComponentLink2URL: http://www.fairchildsemi.com/ds/2N%2F2N3904.pdf
Q5 = 2N3904: NPN General Purpose Amplifier; Published: 8-Jun-2000; LatestRevisionDate: 15-Jan-2003; LatestRevisionNote: PCB Footprint 'BCY-W3/D4.7' replaced; DatasheetVersion: 1997; PackageVersion: Sep-1998; PackageReference: TO-92A; Publisher: Altium Limited; PackageDescription: TO, Flat Index; 3 In-Line, Axial Leads; Body Dia. 4.5mm; Leads 0.51 x 0.48 mm (max); ComponentLink1Description: Manufacturer Link; ComponentLink1URL: http://www.fairchildsemi.com/; ComponentLink2Description: Datasheet; ComponentLink2URL: http://www.fairchildsemi.com/ds/2N%2F2N3904.pdf
R1 = Res1: Resistor; Value: 330R; Published: 8-Jun-2000; Revision: July-2002: Re-released for DXP Platform.; Publisher: Altium Limited
R2 R3 R7 R9 R33 = Res1: Resistor; Published: 8-Jun-2000; Publisher: Altium Limited
  R2 R3 R7: Revision: July-2002: Re-released for DXP Platform.
  R9: Revision: July-2002: Re-released for DXP Platform.; Value: 330
  R33: LatestRevisionDate: 17-Jul-2002; LatestRevisionNote: Re-released for DXP Platform.; PackageReference: AXIAL-0.3
R4-R6 R8 = Res1: Resistor; Value: 0R; Published: 8-Jun-2000; Revision: July-2002: Re-released for DXP Platform.; Publisher: Altium Limited
R10 R38 R63 R80 R82 R88 R89 R91 R94 R97 R103 = res1: Resistor; Value: 1.8K; Published: 8-Jun-2000; LatestRevisionDate: 17-Jul-2002; LatestRevisionNote: Re-released for DXP Platform.; PackageReference: AXIAL-0.3; Publisher: Altium Limited
R11 R29 R39 = RPot: Potentiometer; Sim Note: Enter the Resistance value and the set point into parameter fields.; Set Position: 0.5; Published: 8-Jun-2000; LatestRevisionDate: 17-Jul-2002; LatestRevisionNote: Re-released for DXP Platform.; PackageReference: VR5; Publisher: Altium Limited
  R11 R39: Value: 10K
  R29: Value: 5K
R12-R27 R35-R37 R41 R42 R44-R46 R48-R50 R61 R65 R75-R77 R79 R81 R83 R84 R86 R92 R96 R102 = res1: Resistor; Published: 8-Jun-2000; LatestRevisionDate: 17-Jul-2002; LatestRevisionNote: Re-released for DXP Platform.; PackageReference: AXIAL-0.3; Publisher: Altium Limited
  R86: Value: NA
R28 R30-R32 R34 R40 R43 R47 R93 = RES1
R51-R60 R64 R66-R74 R87 R90 R95 R99 = Res1: Resistor; Value: 1K; Published: 8-Jun-2000; LatestRevisionDate: 17-Jul-2002; LatestRevisionNote: Re-released for DXP Platform.; PackageReference: AXIAL-0.3; Publisher: Altium Limited
R62 R78 R85 R98 R104 = Res3: Resistor; Published: 8-Jun-2000; LatestRevisionDate: 04-Mar-2005; LatestRevisionNote: PCB Footprint replaced.; PackageReference: J1-0603; Publisher: Altium Limited
  R62 R104: Value: 390
  R78: Value: 270
  R85: Value: 220
  R98: Value: 470
S1-S4 = SW-PB: Switch; Published: 24-Mar-1999; LatestRevisionDate: 17-Jul-2002; LatestRevisionNote: Re-released for DXP Platform.; PackageReference: SPST-2; Publisher: Altium Limited
SW1 = SW SPST_1
U1 = XCF02SVO20C: XCF00S Series, Platform Flash In-System Programmable Configuration 3.3V PROM, 20-Pin TSOP, 2-Megabit, Commercial Grade; Package Information: Latest Revision: ver1.0, May-2003; Code - JEDEC: MO-153-AC; Published: 17-Sep-2003; Datasheet: Latest Revision: ver2.2, Dec-2003; Package Reference: VO20; Publisher: Altium Limited
U2 = XC3S400-4PQ208C: Spartan-3 1.2V FPGA, 141 User I/Os, 208-Pin PQFP, Standard Performance, Commercial Grade; Ordering Information: Additional code may have to be appended for different mask revision devices.; Published: 17-Sep-2003; LatestRevisionDate: 13-Apr-2006; LatestRevisionNote: IPC-7351 Footprint Added.; DatasheetVersion: ver2.3, Nov-2007; PackageVersion: ver1.2, Jun-2004; PackageReference: PQ208; Publisher: Altium Limited; PackageDescription: 208-Pin Plastic Quad Flat Pack (PQ208); Code_JEDEC: MS-029-FA-1; ComponentLink1Description: Manufacturer Link; ComponentLink1URL: http://www.xilinx.com/products/silicon_solutions/fpgas/spartan_series/spartan3_fpgas/index.htm; ComponentLink2Description: Datasheet; ComponentLink2URL: http://direct.xilinx.com/bvdocs/publications/ds099.pdf
U4 = CY62148EV30: 512Kx8 Bit  Static RAM(3.3V Operating).
U5 U9 = LM386M-1: Low Voltage Audio Power Amplifier; Manufacturer: National Semiconductor; CompType: Audio IC; PackageTopMarking: NSZXTT*LM386*M-1; Published: 4-Dec-2008; DatasheetVersion: Aug-2000; PackageVersion: revL, Sep-2006; PackageReference: M08A; PackageDescription: SOIC Narrow, 4.9 x 3.9 x 1.45mm, 8 Lead, 1.27mm Pitch; PartNumber: LM386M-1; RoHS: O; PinCount: 8; DigiKeyPartNumber: LM386M-1-ND; Code_JEDEC: MS-012-AA; Code_IPC: SOIC127P600-8; ComponentLink1Description: LM386 Datasheet; ComponentLink1URL: http://www.national.com/ds/LM/LM386.pdf; ComponentLink2Description: LM386 Web Page; ComponentLink2URL: http://www.national.com/pf/LM/LM386.html; ComponentLink3Description: M08A Package Page; ComponentLink3URL: http://www.national.com/packaging/folders/m08a.html
U7 = FT245BL: USB FIFO ( USB - Parallel)
U8 = AT93C46: Three-wire Serial Epprom
U10 U12 U13 U15 = LM1085IT-ADJ: 3A Low Dropout Positive Regulators; Manufacturer: National Semiconductor; CompType: LDO IC; PackageTopMarking: NSUZXYTTE#*LM1085*IT-ADJ; Published: 4-Dec-2008; DatasheetVersion: Jun-2005; PackageVersion: revL, Jan-1992; PackageReference: T03B; Publisher: Altium Limited; PackageDescription: TO-220, Molded, 3 Lead, Straight; PartNumber: LM1085IT-ADJ; RoHS: O; PinCount: 3; DigiKeyPartNumber: LM1085IT-ADJ-ND; ComponentLink1Description: LM1085 Datasheet; ComponentLink1URL: http://www.national.com/ds/LM/LM1085.pdf; ComponentLink2Description: LM1085 Web Page; ComponentLink2URL: http://www.national.com/pf/LM/LM1085.html; ComponentLink3Description: T03B Package Page; ComponentLink3URL: http://www.national.com/packaging/folders/t03b.html
U11 = MAX3232CUE: 3.0V TO 5.5V, Low-Power, up to 1Mbps, True RS-232 Transceiver Using Four 0.1µF External Capacitor; Published: 16-Jan-2001; LatestRevisionDate: 29-May-2009; LatestRevisionNote: IPC-7351 Footprint Added.; DatasheetVersion: Mar-1999; PackageVersion: 21-0066 C; PackageReference: TSSOP16; Publisher: Altium Limited; PackageDescription: 16-Pin Thin Small Outline Package 0.65 mm Pitch; ComponentLink1Description: Manufacturer Link; ComponentLink1URL: http://www.maxim-ic.com/; ComponentLink2Description: Datasheet; ComponentLink2URL: http://pdfserv.maxim-ic.com/en/ds/MAX3222-MAX3241.pdf
Y1 = CRYSTAL
Y2 = OSC. CRYSTAL: OSC.